# Altium schematic sheet LED_MAX_LCD_USB.SchDoc
size 420 x 297 mm; Organization: Altium Limited; Address1: L3, 12a Rodborough Rd; Address2: Frenchs Forest; Address3: NSW; Address4: Australia 2086
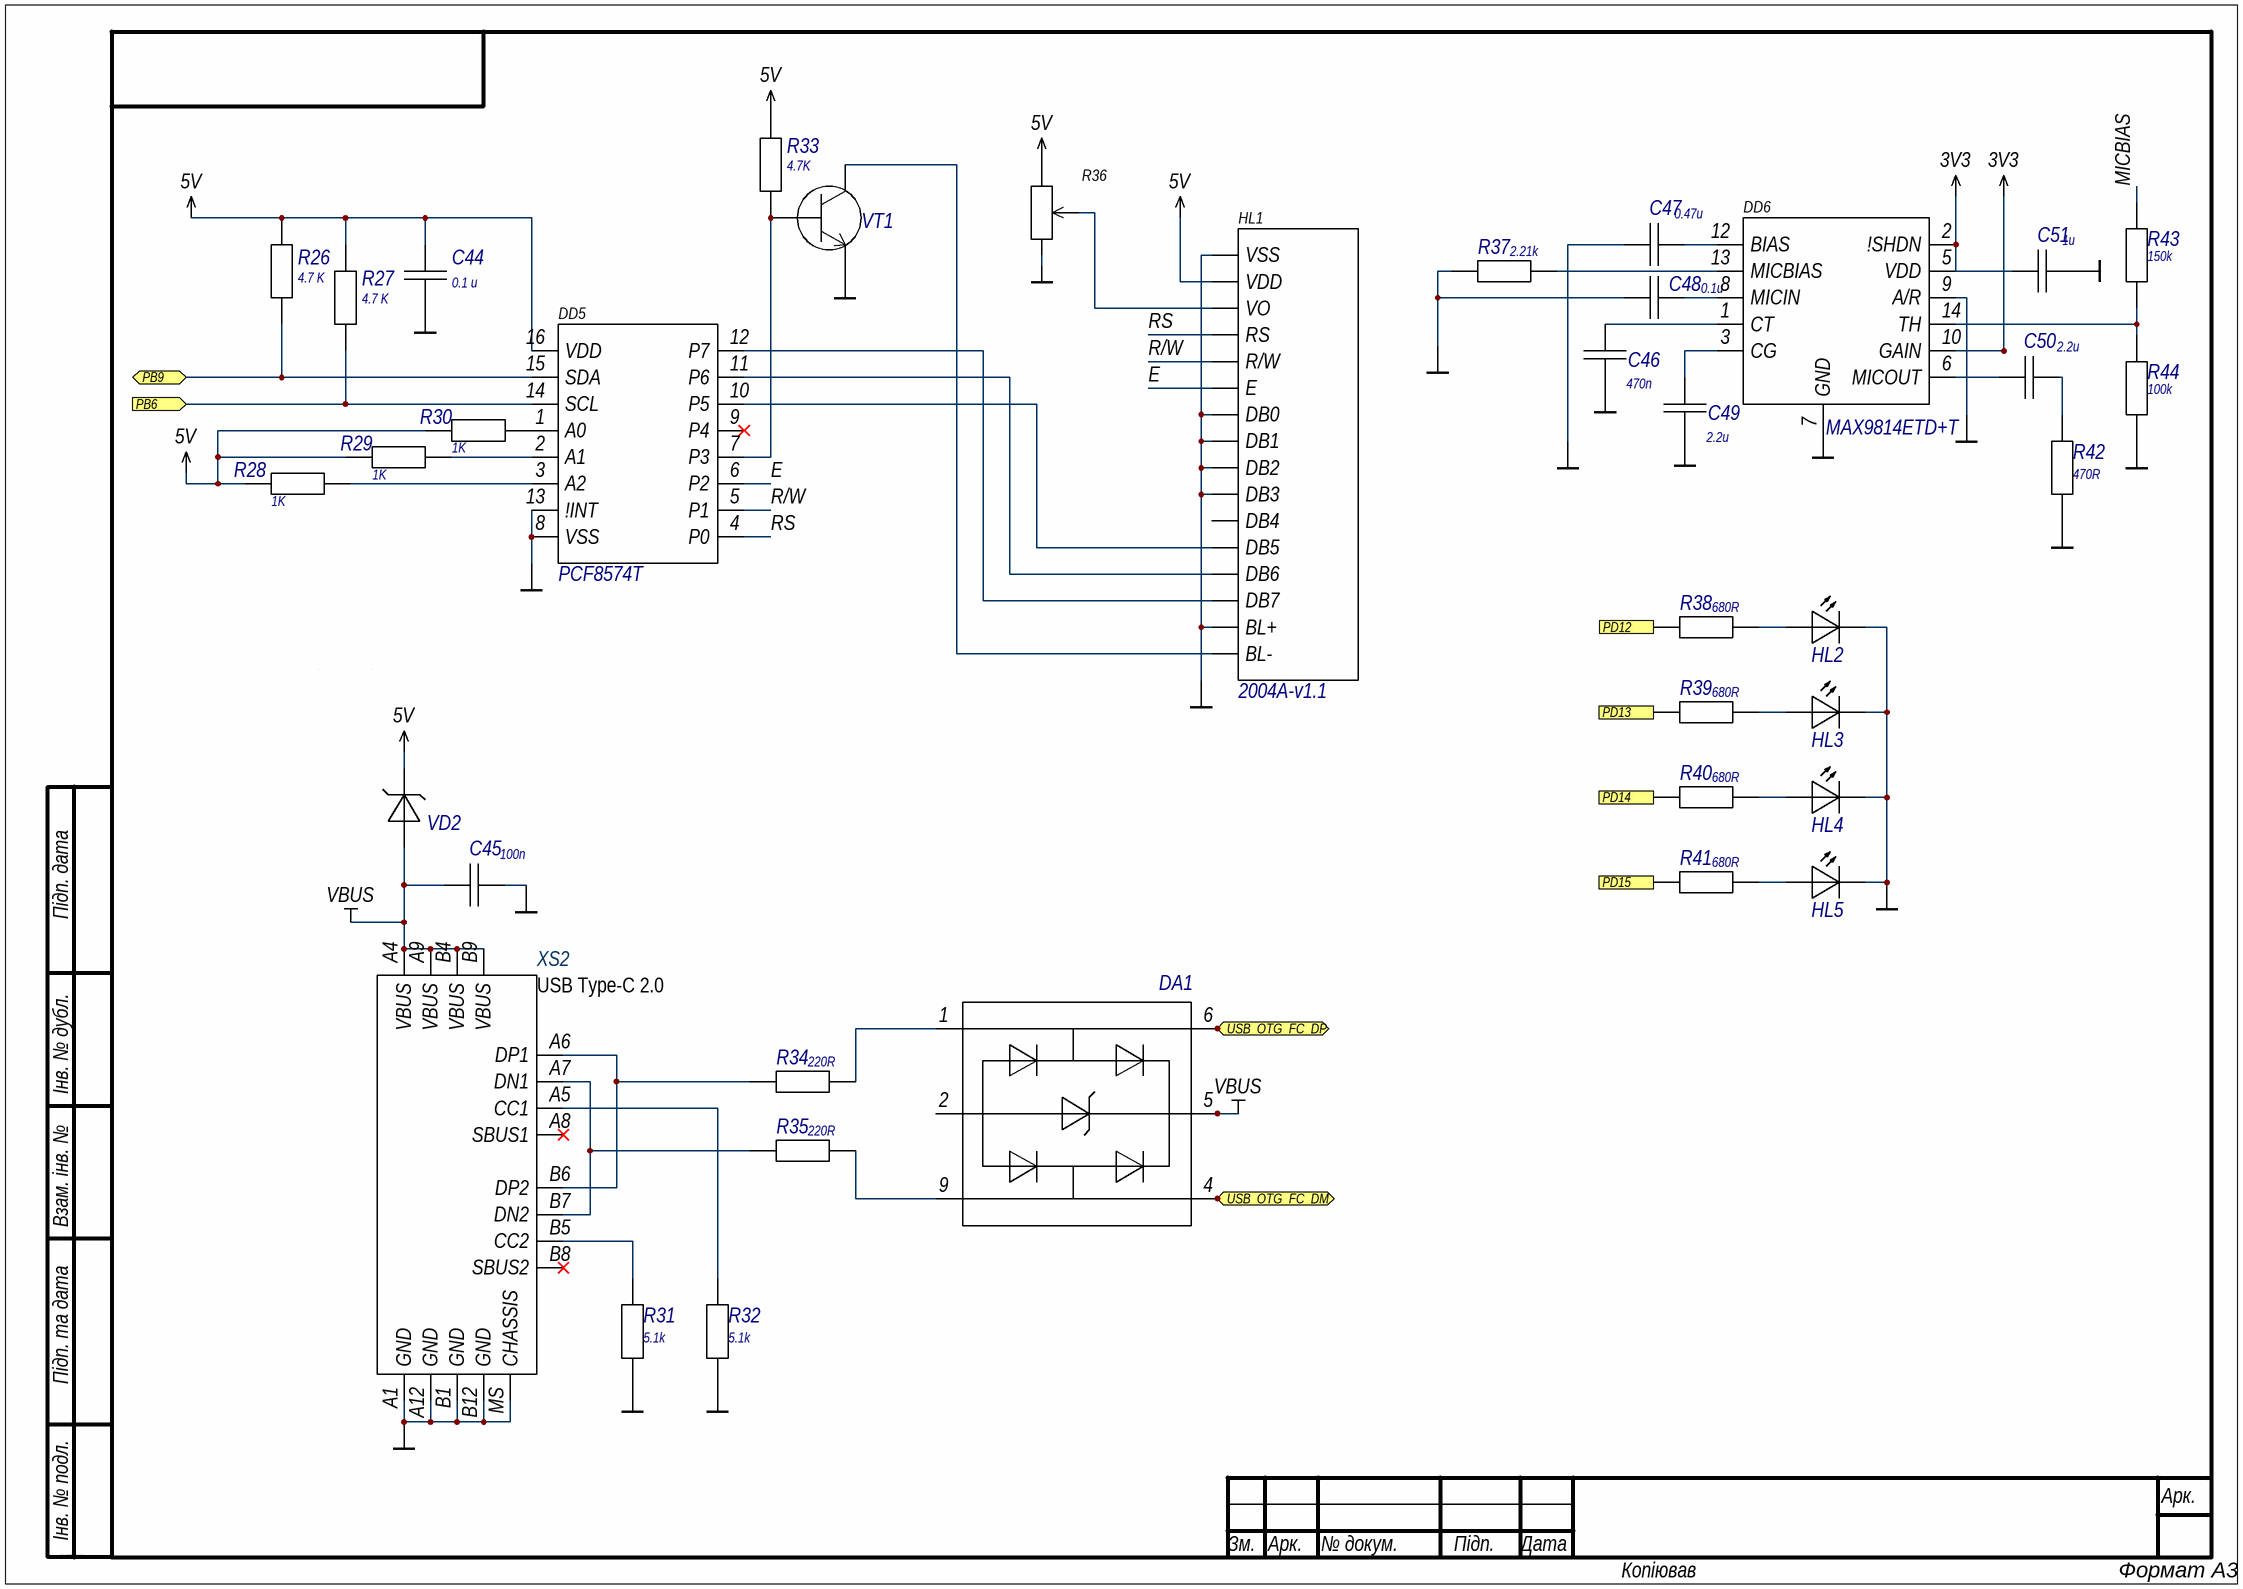
[diagram p0: LED_MAX_LCD_USB.SchDoc]

## Parts
C44  value 0.1 u  [C_0603]
C45  value 100n  [C_0603]
C46  value 470n  [C_0603]
C47  value 0.47u  [C_0603]
C48  value 0.1u  [C_0603]
C49  value 2.2u  [C_0603]
C50  value 2.2u  [C_0603]
C51  value 1u  [C_0603]
DA1  (no value)  [SOT-23-6L]
DD5  Name: PCF8574T  [PCF8574TS]  (hidden comment: PCF8574T NXP USA Inc.)
DD6  Name: MAX9814ETD+T  [MAX9814]  (hidden comment: MAX9814ETD+T Analog Devices Inc./Maxim Integrated)
HL1  Name: 2004A-v1.1  [lcd]  (hidden comment: LCD)
HL2  (no value)  [LED]
HL3  (no value)  [LED]
HL4  (no value)  [LED]
HL5  (no value)  [LED]
R26  value 4.7 K  [R0_0603]  (hidden comment: 0603 В 4.7 K 1% Keystone Electronics)
R27  value 4.7 K  [R0_0603]  (hidden comment: 0603 В 4.7 K 1% Keystone Electronics)
R28  value 1K  [R0_0603]  (hidden comment: 0603 В 1K 1% Keystone Electronics)
R29  value 1K  [R0_0603]  (hidden comment: 0603 В 1K 1% Keystone Electronics)
R30  value 1K  [R0_0603]  (hidden comment: 0603 В 1K 1% Keystone Electronics)
R31  value 5.1k  [R0_0603]  (hidden comment: 0603 0 В 5.1k 1% Keystone Electronics)
R32  value 5.1k  [R0_0603]  (hidden comment: 0603 0 В 5.1k 1% Keystone Electronics)
R33  value 4.7K  [R0_0603]  (hidden comment: 0603 В 4.7K 1% Keystone Electronics)
R34  value 220R  [R0_0603]  (hidden comment: 0603 0 В 220R 1% Keystone Electronics)
R35  value 220R  [R0_0603]  (hidden comment: 0603 0 В 220R 1% Keystone Electronics)
R36  RHEOSTAT  [RHEOSTAT]  (value not drawn)
R37  value 2.21k  [R0_0603]  (hidden comment: 0603 0 В 2.21k 1% Keystone Electronics)
R38  value 680R  [R0_0603]  (hidden comment: 0603 0 В 680R 1% Keystone Electronics)
R39  value 680R  [R0_0603]  (hidden comment: 0603 0 В 680R 1% Keystone Electronics)
R40  value 680R  [R0_0603]  (hidden comment: 0603 0 В 680R 1% Keystone Electronics)
R41  value 680R  [R0_0603]  (hidden comment: 0603 0 В 680R 1% Keystone Electronics)
R42  value 470R  [R0_0603]  (hidden comment: 0603 0 В 470R 1% Keystone Electronics)
R43  value 150k  [R0_0603]  (hidden comment: 0603 0 В 150k 1% Keystone Electronics)
R44  value 100k  [R0_0603]  (hidden comment: 0603 0 В 100k 1% Keystone Electronics)
VD2  (no value)  [BAT60JFILM]
VT1  (no value)  [SOT-23]
XS2  USB Type-C 2.0  [SAMESKY_UJ20-C-H-G-SMT-1-P16-TR]

## Ports
PB6 (in), PB9 (bidir), PD12 (in), PD13 (in), PD14 (in), PD15 (in), USB_OTG_FC_DM (bidir), USB_OTG_FC_DP (bidir)

## Nets
3V3: C51.1 DD6.2(!SHDN) DD6.5(VDD) DD6.10(GAIN)
5V: C44.2 DD5.16(VDD) HL1.2(VDD) R26.2 R27.2 R28.2 R29.2 R30.2 R33.2 R36.MH1 VD2.2
GND: C44.1 C45.2 C46.2 C47.2 C48.2 C49.2 C51.2 DD5.8(VSS) DD5.13(!INT) DD6.7(GND) DD6.9(A/R) HL1.1(VSS) HL1.7(DB0) HL1.8(DB1) HL1.9(DB2) HL1.10(DB3) HL1.15(BL+) HL2.2 HL3.2 HL4.2 HL5.2 R31.1 R32.1 R36.MH2 R37.1 R42.1 R44.1 VT1.2 XS2.A1(GND) XS2.A12(GND) XS2.B1(GND) XS2.B12(GND) XS2.MS(CHASSIS)
VBUS: C45.1 DA1.5 VD2.1 XS2.A4(VBUS) XS2.A9(VBUS) XS2.B4(VBUS) XS2.B9(VBUS)
E: DD5.6(P2) HL1.6(E)
MICBIAS: R43.2
PB6: DD5.14(SCL) R27.1 ; port PB6
PB9: DD5.15(SDA) R26.1 ; port PB9
PD12: R38.1 ; port PD12
PD13: R39.1 ; port PD13
PD14: R40.1 ; port PD14
PD15: R41.1 ; port PD15
R/W: DD5.5(P1) HL1.5(R/W)
RS: DD5.4(P0) HL1.4(RS)
USB_OTG_FC_DM: DA1.4 ; port USB_OTG_FC_DM
USB_OTG_FC_DP: DA1.6 ; port USB_OTG_FC_DP
NetC46_1: C46.1 DD6.1(CT)
NetC47_1: C47.1 DD6.12(BIAS)
NetC48_1: C48.1 DD6.8(MICIN)
NetC49_1: C49.1 DD6.3(CG)
NetC50_1: C50.1 DD6.6(MICOUT)
NetC50_2: C50.2 R42.2
NetDA1_1: DA1.1 R34.1
NetDA1_9: DA1.9 R35.1
NetDD5_1: DD5.1(A0) R30.1
NetDD5_2: DD5.2(A1) R29.1
NetDD5_3: DD5.3(A2) R28.1
NetDD5_7: DD5.7(P3) R33.1 VT1.3
NetDD5_10: DD5.10(P5) HL1.12(DB5)
NetDD5_11: DD5.11(P6) HL1.13(DB6)
NetDD5_12: DD5.12(P7) HL1.14(DB7)
NetDD6_13: DD6.13(MICBIAS) R37.2
NetDD6_14: DD6.14(TH) R43.1 R44.2
NetHL1_3: HL1.3(VO) R36.A3
NetHL1_16: HL1.16(BL-) VT1.1
NetHL2_1: HL2.1 R38.2
NetHL3_1: HL3.1 R39.2
NetHL4_1: HL4.1 R40.2
NetHL5_1: HL5.1 R41.2
NetR31_2: R31.2 XS2.B5(CC2)
NetR32_2: R32.2 XS2.A5(CC1)
NetR34_2: R34.2 XS2.A6(DP1) XS2.B6(DP2)
NetR35_2: R35.2 XS2.A7(DN1) XS2.B7(DN2)

Not connected (* = marked no-connect by the designer): DA1 2; DD5 9(P4)*; HL1 11(DB4); XS2 A8(SBUS1)* B8(SBUS2)*

## Notes on the sheet
- Підп. дата
- Інв. № дубл.
- Взам. інв. №
- Підп. та дата
- Інв. № подл.
- Зм.
- Арк.
- № докум.
- Підп.
- Дата
- ALTIUM GOSTBOM2.0 KEV
- Копіював
- Формат А3

## Library data of the parts
C44-C51 = C_0603: Manufacturer: TDK Corporation; Temp_Coef: X7R; Voltage: 50 В; Tolerance: 10%; Package: 0603
DA1 = USBLC6-2SC6: 17V Clamp 5A (8/20Âµs) Ipp Tvs Diode Surface Mount, SOT-23-6; Manufacturer: STMicroelectronics; Name: USBLC6-2SC6
DD5 = PCF8574TS: Manufacturer: NXP USA Inc.
DD6 = MAX9814: Manufacturer: Analog Devices Inc./Maxim Integrated
HL1 = LCD: Manufacturer: Shenzhen Eone Electronics
HL2-HL5 = LED: Manufacturer: Cree LED; Name: XPEBFR-LS-0000-00A01
R26-R30 R33 = R_0603: Package: 0603; Power: В; Tolerance: 1%; Manufacturer: Keystone Electronics
R31 R32 R34 R35 R37-R44 = R_0603: Power: 0 В; Package: 0603; Tolerance: 1%; Manufacturer: Keystone Electronics
R36 = RHEOSTAT: Manufacturer: Bourns Inc.; Name: PTV09A-2015U-B103
VD2 = DIODE_SCHOTTKY: Manufacturer: STMicroelectronics
VT1 = NPN: Manufacturer: onsemi; Name: MMBTA06LT1G
XS2 = USB Type-C 2.0: Conn USB 2.0 Type C RCP 16 POS 0.85mm Solder RA Thru-Hole 16 Terminal 1 Port T/R; pin to pad: A1>B1_A12 A4>A4_B9 A9>B4_A9 A12>A1_B12 B1>A1_B12 B4>B4_A9 B9>A4_B9 B12>B1_A12; Manufacturer: Same Sky; Part Number: UJ20-C-H-G-SMT-TR